# Altium schematic sheet Camera + Display.SchDoc
size A; SheetNumber: 9; SheetTotal: 9
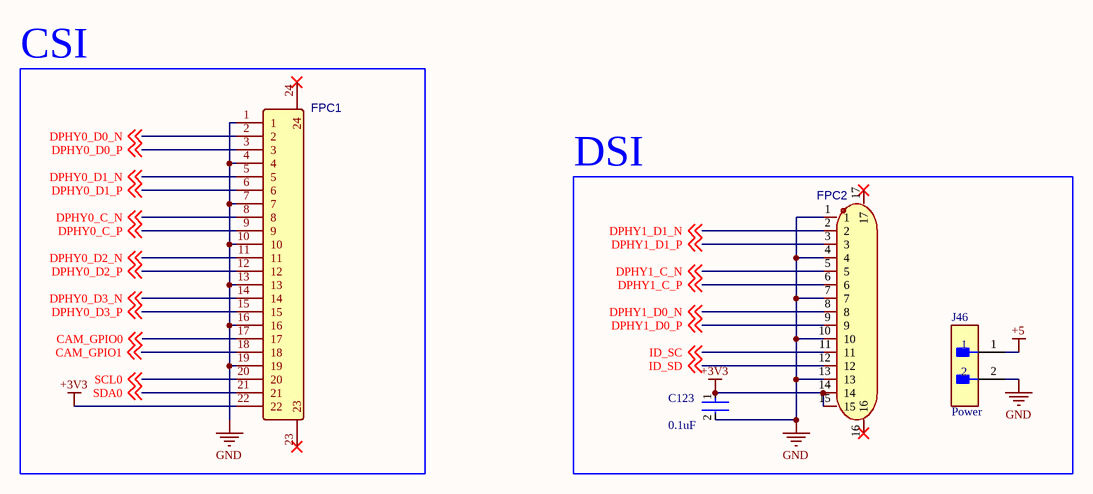
[diagram p0: Camera + Display.SchDoc]

## Parts
C123  0.1uF  [FP-C0402-BB-MFG]
FPC1  AFC01-S22FCA-00  [FPC-SMD_P0.5-22P_FGS-XJ-H2.0]  (value not drawn)
FPC2  HC-FPC-1.0-15P-FHH20  [FPC-SMD_15P-P0.50_HC-FPC-1.0-15P-FHH20]  (value not drawn)
J46  Power  [FP-TSW-102-14-G-S-MFG]

## Blocks framed on the sheet
CSI: FPC1
DSI: C123 FPC2 J46

## Nets
+3V3: C123.1 FPC1.22 FPC2.14 FPC2.15
+5: J46.1
GND: C123.2 FPC1.1 FPC1.4 FPC1.7 FPC1.10 FPC1.13 FPC1.16 FPC1.19 FPC2.1 FPC2.4 FPC2.7 FPC2.10 FPC2.13 J46.2
CAM_GPIO0: FPC1.17 ; off-sheet CAM_GPIO0
CAM_GPIO1: FPC1.18 ; off-sheet CAM_GPIO1
DPHY0_C_N: FPC1.8 ; off-sheet DPHY0_C_N
DPHY0_C_P: FPC1.9 ; off-sheet DPHY0_C_P
DPHY0_D0_N: FPC1.2 ; off-sheet DPHY0_D0_N
DPHY0_D0_P: FPC1.3 ; off-sheet DPHY0_D0_P
DPHY0_D1_N: FPC1.5 ; off-sheet DPHY0_D1_N
DPHY0_D1_P: FPC1.6 ; off-sheet DPHY0_D1_P
DPHY0_D2_N: FPC1.11 ; off-sheet DPHY0_D2_N
DPHY0_D2_P: FPC1.12 ; off-sheet DPHY0_D2_P
DPHY0_D3_N: FPC1.14 ; off-sheet DPHY0_D3_N
DPHY0_D3_P: FPC1.15 ; off-sheet DPHY0_D3_P
DPHY1_C_N: FPC2.5 ; off-sheet DPHY1_C_N
DPHY1_C_P: FPC2.6 ; off-sheet DPHY1_C_P
DPHY1_D0_N: FPC2.8 ; off-sheet DPHY1_D0_N
DPHY1_D0_P: FPC2.9 ; off-sheet DPHY1_D0_P
DPHY1_D1_N: FPC2.2 ; off-sheet DPHY1_D1_N
DPHY1_D1_P: FPC2.3 ; off-sheet DPHY1_D1_P
ID_SC: FPC2.11 ; off-sheet ID_SC
ID_SD: FPC2.12 ; off-sheet ID_SD
SCL0: FPC1.20 ; off-sheet SCL0
SDA0: FPC1.21 ; off-sheet SDA0

Not connected (* = marked no-connect by the designer): FPC1 23* 24*; FPC2 16* 17*

## Library data of the parts
C123 = CMP-03020-014070-2: C307331; Manufacturer: Kemet; Manufacturer Part Number: C0402C104M3PAC7867; Material: Ceramic; Tolerance: 0.2; Temperature Characteristic: X5R; Value: 0.10 μF; Temperature Coefficient: 15%; Voltage Rating: 25 V; Height: 0.55mm; Category: Cap; Temperature: -55°C to +125°C; Automotive: No; Package: C0402-BB; Temperature Range Low: -55°C; ComponentLink2Description: Datasheet; Device Class L3: Ceramic Capacitors; ComponentLink2URL: https://content.kemet.com/datasheets/KEM_C1002_X7R_SMD.pdf; Octopart: https://octopart.com/c0402c104m3pac7867-kemet-84304880; RoHS: TRUE; Temperature Range High: +125°C; Device Class L1: Passive Components; Capacitance: 0.10 μF; Lead Free: Yes; Ipc Land Pattern Name: CAPC10050X50; Device Class L2: Capacitors; Digikey Description: CAP CER 0.1UF 25V X5R 0402
FPC1 = CSI Bottom Contact Right Angle: C262668; Manufacturer: JS(钜硕电子); Contributor: LCSC; Supplier: LCSC; Supplier Part: C262668; Manufacturer Part: AFC01-S22FCA-00; JLCPCB Part Class: Extended Part; spicePre: F; spiceSymbolName: AFC01-S22FCA-00
FPC2 = DSI Top and Bottom Connector: C49166884; Manufacturer: HC(虹成电子); Add into BOM: yes; Locking Feature: Hinged Lid; Number of Contacts: 15P; Pitch: 1mm; FFC, FCB Thickness: 0.3mm; Symbol: HC-FPC-1.0-15P-FHH20; Device: HC-FPC-1.0-15P-FHH20; LCSC Part Name: 翻盖式 双侧触点/上下接 P数:15P 间距:1mm; Supplier Part: C49166884; Manufacturer Part: HC-FPC-1.0-15P-FHH20; Supplier Footprint: SMD,P=1mm,卧贴; JLCPCB Part Class: Extended Part; Datasheet: https://item.szlcsc.com/datasheet/HC-FPC-1.0-15P-FHH20/51557854.html; Supplier: LCSC; Convert to PCB: yes; Contact Type: Double-Sided Contacts, Top and Bottom Entry; Mounting Type: Surface Mount, Right Angle; Height Above Board: 2mm; Contact Material: -; Contact Plating: -; Operating Temperature: -40℃~+85℃
J46 = CMP-02766-001740-1: CONN HEADER VERT 2POS 2.54MM; Number of Positions: 2; Max Current Rating: 7.6A; Gender: Male; Max Voltage Rating (AC): 550V; Contact Mating Length: 0.32inch; REACH SVHC: No SVHC; Width: 2.54mm; Insulation Material: PBT; Contact Shape: Square; Contact Plating: Gold; Min Operating Temperature: -55°C; Contact Material: Bronze; Color: Black; Number of Contacts: 2; Housing Material: Polyester; Orientation: Straight; Flammability Rating: UL94 V-0; Max Operating Temperature: 125°C; Contact Type: Male Pin; Radiation Hardening: No; Termination: Solder; RoHS Compliant: Yes; Lead Free: Lead Free; Fastening Type: Pull; Pitch: 2.54mm; Number of Rows: 1; Series: TSW; Insulation Color: Black; Package Quantity: 1; Connector Type: Header; Length: 5.08mm; Contact Finish - Mating: GOLD; Mount: Through Hole; Housing Color: Black; Depth: 2.54mm; Packaging: Bulk